# EAGLE design Digital Input Board (EAGLE 7.6.0)
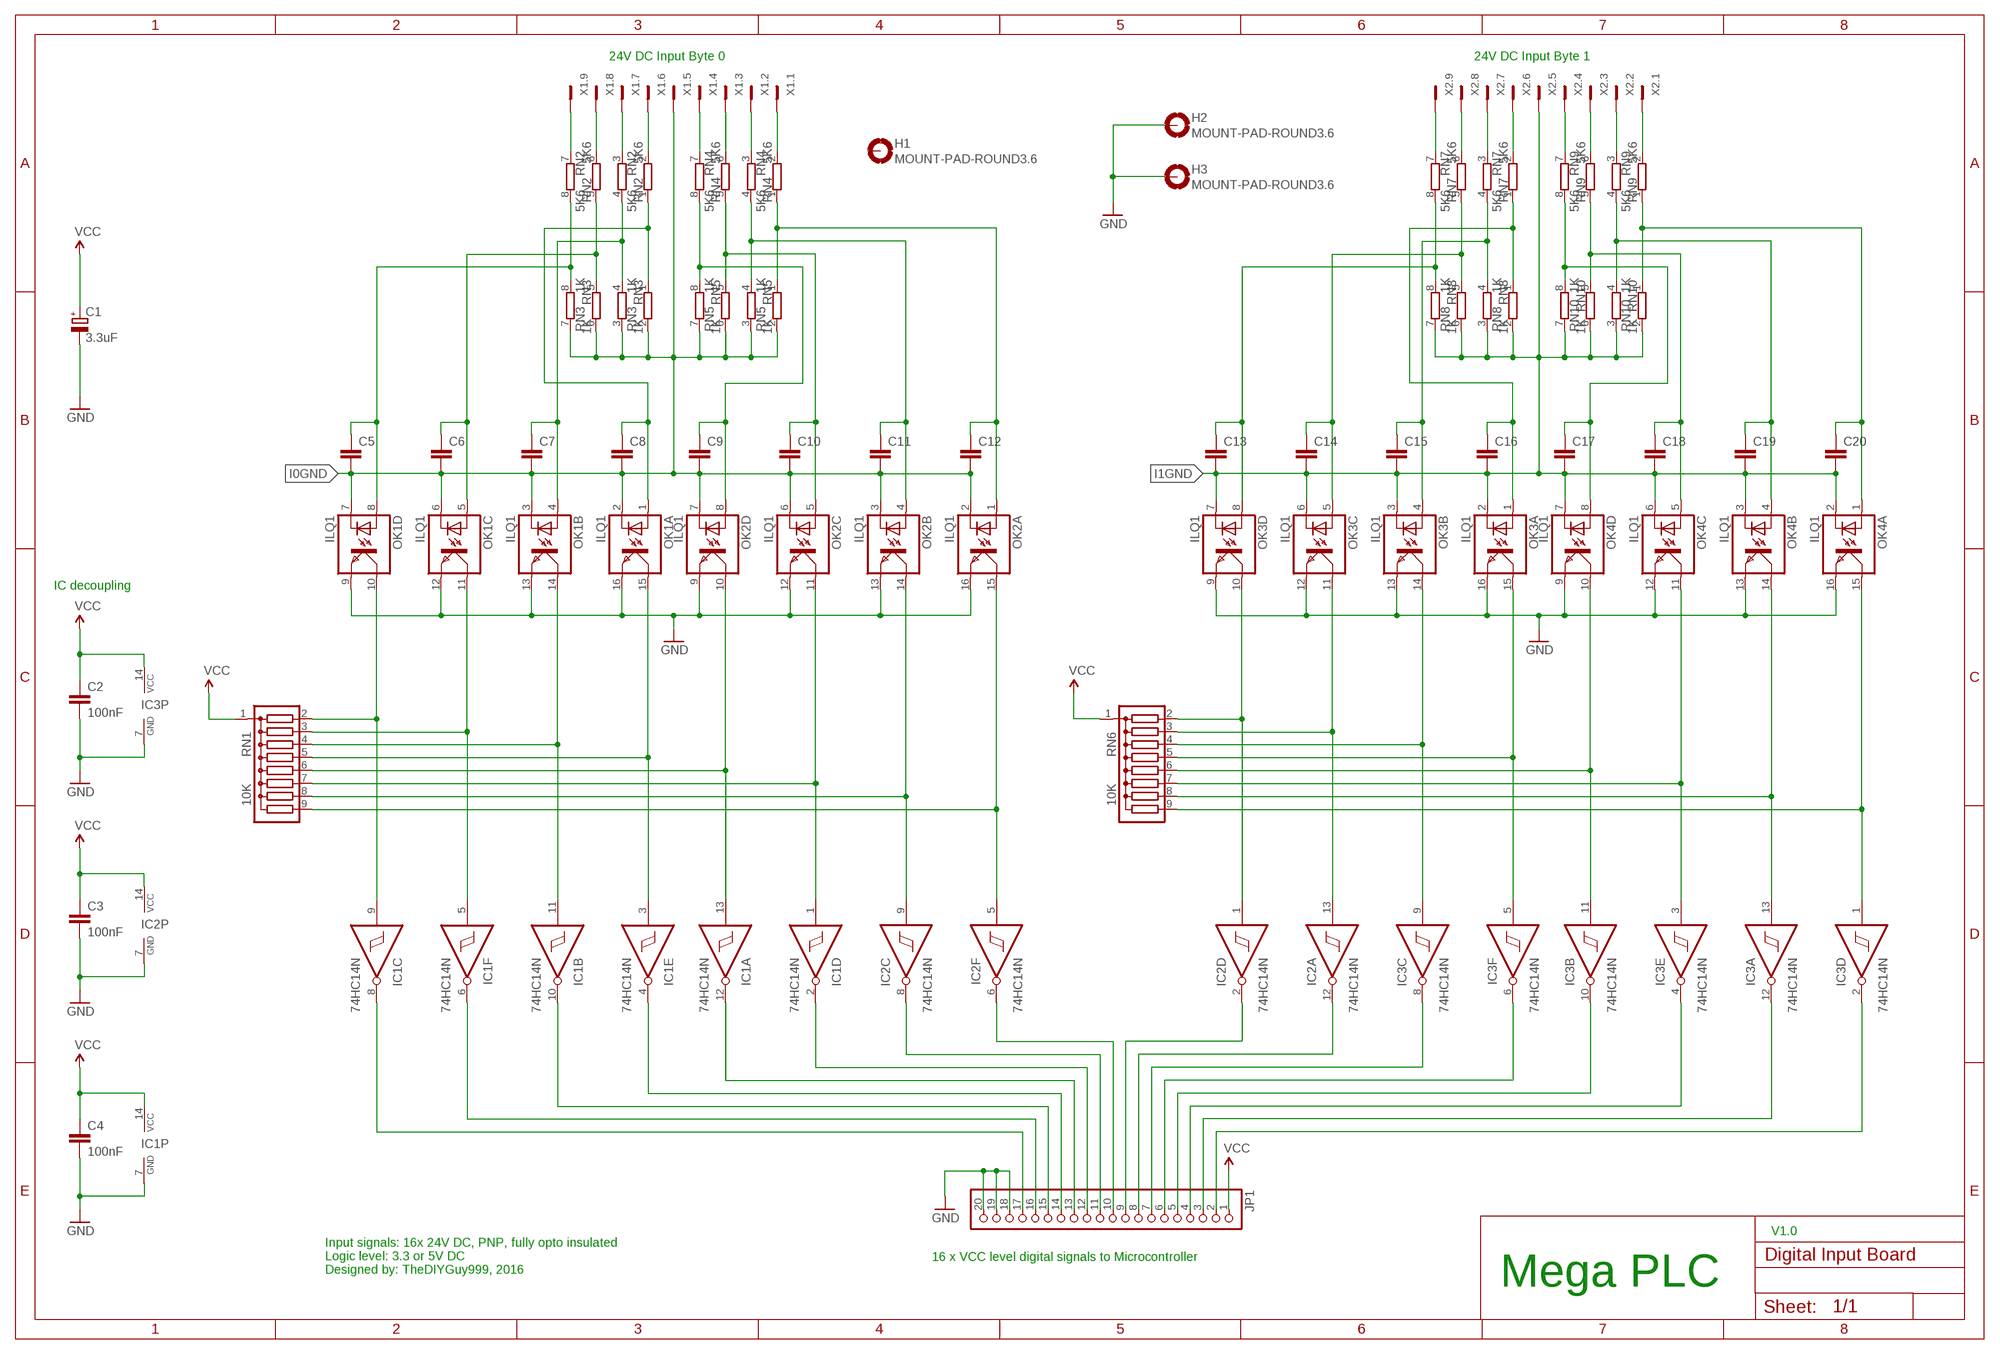
[diagram p0: schematic, sheet 1]

## Parts
C1  3.3uF  CPOL-EUB45181A  [B45181A]
C2  100nF  C-EU025-024X044  [C025-024X044]
C3  100nF  C-EU025-024X044  [C025-024X044]
C4  100nF  C-EU025-024X044  [C025-024X044]
C5  C-EUC0805K  [C0805K]
C6  C-EUC0805K  [C0805K]
C7  C-EUC0805K  [C0805K]
C8  C-EUC0805K  [C0805K]
C9  C-EUC0805K  [C0805K]
C10  C-EUC0805K  [C0805K]
C11  C-EUC0805K  [C0805K]
C12  C-EUC0805K  [C0805K]
C13  C-EUC0805K  [C0805K]
C14  C-EUC0805K  [C0805K]
C15  C-EUC0805K  [C0805K]
C16  C-EUC0805K  [C0805K]
C17  C-EUC0805K  [C0805K]
C18  C-EUC0805K  [C0805K]
C19  C-EUC0805K  [C0805K]
C20  C-EUC0805K  [C0805K]
H1  MOUNT-PAD-ROUND3.6  [3,6-PAD]
H2  MOUNT-PAD-ROUND3.6  [3,6-PAD]
H3  MOUNT-PAD-ROUND3.6  [3,6-PAD]
IC1  74HC14N  [DIL14]
IC2  74HC14N  [DIL14]
IC3  74HC14N  [DIL14]
JP1  PINHD-1X20/90  [1X20/90]
OK1  ILQ1  [DIL16]
OK2  ILQ1  [DIL16]
OK3  ILQ1  [DIL16]
OK4  ILQ1  [DIL16]
RN1  10K  G08R  [SIL9]
RN2  5K6  E4RP  [SIL8]
RN3  1K  E4RP  [SIL8]
RN4  5K6  E4RP  [SIL8]
RN5  1K  E4RP  [SIL8]
RN6  10K  G08R  [SIL9]
RN7  5K6  E4RP  [SIL8]
RN8  1K  E4RP  [SIL8]
RN9  5K6  E4RP  [SIL8]
RN10  1K  E4RP  [SIL8]
X1  MC9  [MC9]
X2  MC9  [MC9]

## Nets
GND [GND]: C1.- C2.2 C3.2 C4.2 H2.B3,6(MOUNT) H3.B3,6(MOUNT) IC1.7(P:GND) IC2.7(P:GND) IC3.7(P:GND) JP1.18 JP1.19 JP1.20 OK1.9(D:EMIT) OK1.12(C:EMIT) OK1.13(B:EMIT) OK1.16(A:EMIT) OK2.9(D:EMIT) OK2.12(C:EMIT) OK2.13(B:EMIT) OK2.16(A:EMIT) OK3.9(D:EMIT) OK3.12(C:EMIT) OK3.13(B:EMIT) OK3.16(A:EMIT) OK4.9(D:EMIT) OK4.12(C:EMIT) OK4.13(B:EMIT) OK4.16(A:EMIT)
I0GND [GND]: C5.2 C6.2 C7.2 C8.2 C9.2 C10.2 C11.2 C12.2 OK1.2(A:C) OK1.3(B:C) OK1.6(C:C) OK1.7(D:C) OK2.2(A:C) OK2.3(B:C) OK2.6(C:C) OK2.7(D:C) RN3.2 RN3.3 RN3.6 RN3.7 RN5.2 RN5.3 RN5.6 RN5.7 X1.5
I1GND [GND]: C13.2 C14.2 C15.2 C16.2 C17.2 C18.2 C19.2 C20.2 OK3.2(A:C) OK3.3(B:C) OK3.6(C:C) OK3.7(D:C) OK4.2(A:C) OK4.3(B:C) OK4.6(C:C) OK4.7(D:C) RN8.2 RN8.3 RN8.6 RN8.7 RN10.2 RN10.3 RN10.6 RN10.7 X2.5
N$1 [24V]: RN9.7 X2.4
N$2 [24V]: RN9.6 X2.3
N$3 [24V]: RN9.3 X2.2
N$4 [24V]: RN9.2 X2.1
N$5: C20.1 OK4.1(A:A) RN9.1 RN10.1
N$6: C19.1 OK4.4(B:A) RN9.4 RN10.4
N$7: C18.1 OK4.5(C:A) RN9.5 RN10.5
N$8: C17.1 OK4.8(D:A) RN9.8 RN10.8
N$9: IC3.1(D:I) OK4.15(A:COL) RN6.9
N$10: IC3.13(A:I) OK4.14(B:COL) RN6.8
N$11: IC3.3(E:I) OK4.11(C:COL) RN6.7
N$12 [24V]: RN7.2 X2.6
N$13: IC2.13(A:I) OK3.11(C:COL) RN6.3
N$14 [24V]: RN7.7 X2.9
N$15: IC3.11(B:I) OK4.10(D:COL) RN6.6
N$16 [24V]: RN7.6 X2.8
N$17 [24V]: RN7.3 X2.7
N$18: C16.1 OK3.1(A:A) RN7.1 RN8.1
N$19: C15.1 OK3.4(B:A) RN7.4 RN8.4
N$20: C14.1 OK3.5(C:A) RN7.5 RN8.5
N$21: C13.1 OK3.8(D:A) RN7.8 RN8.8
N$22: IC3.5(F:I) OK3.15(A:COL) RN6.5
N$23: IC3.9(C:I) OK3.14(B:COL) RN6.4
N$24: C12.1 OK2.1(A:A) RN4.1 RN5.1
N$25: C11.1 OK2.4(B:A) RN4.4 RN5.4
N$26: C10.1 OK2.5(C:A) RN4.5 RN5.5
N$27: C9.1 OK2.8(D:A) RN4.8 RN5.8
N$28 [24V]: RN4.7 X1.4
N$29 [24V]: RN4.6 X1.3
N$30 [24V]: RN4.3 X1.2
N$31 [24V]: RN4.2 X1.1
N$32: IC2.1(D:I) OK3.10(D:COL) RN6.2
N$33: IC2.5(F:I) OK2.15(A:COL) RN1.9
N$34: IC2.9(C:I) OK2.14(B:COL) RN1.8
N$35: IC1.1(D:I) OK2.11(C:COL) RN1.7
N$36 [24V]: RN2.2 X1.6
N$37 [24V]: RN2.6 X1.8
N$38 [24V]: RN2.7 X1.9
N$39 [24V]: RN2.3 X1.7
N$40: C8.1 OK1.1(A:A) RN2.1 RN3.1
N$41: C7.1 OK1.4(B:A) RN2.4 RN3.4
N$42: C6.1 OK1.5(C:A) RN2.5 RN3.5
N$43: C5.1 OK1.8(D:A) RN2.8 RN3.8
N$44: IC1.13(A:I) OK2.10(D:COL) RN1.6
N$45: IC1.3(E:I) OK1.15(A:COL) RN1.5
N$46: IC1.11(B:I) OK1.14(B:COL) RN1.4
N$47: IC1.5(F:I) OK1.11(C:COL) RN1.3
N$48: IC1.9(C:I) OK1.10(D:COL) RN1.2
N$49: IC3.2(D:O) JP1.2
N$50: IC3.12(A:O) JP1.3
N$51: IC3.4(E:O) JP1.4
N$52: IC3.10(B:O) JP1.5
N$53: IC3.6(F:O) JP1.6
N$54: IC3.8(C:O) JP1.7
N$55: IC2.12(A:O) JP1.8
N$56: IC2.2(D:O) JP1.9
N$57: IC2.6(F:O) JP1.10
N$58: IC2.8(C:O) JP1.11
N$59: IC1.2(D:O) JP1.12
N$60: IC1.12(A:O) JP1.13
N$61: IC1.4(E:O) JP1.14
N$62: IC1.10(B:O) JP1.15
N$63: IC1.6(F:O) JP1.16
N$64: IC1.8(C:O) JP1.17
VCC [VCC]: C1.+ C2.1 C3.1 C4.1 IC1.14(P:VCC) IC2.14(P:VCC) IC3.14(P:VCC) JP1.1 RN1.1 RN6.1
Unconnected: H1.B3,6(MOUNT) IC2.3(E:I) IC2.4(E:O) IC2.10(B:O) IC2.11(B:I)

## Notes on the sheet
- 24V DC Input Byte 0 | 24V DC Input Byte 1
- IC decoupling
- V1.0
- 16 x VCC level digital signals to Microcontroller
- Input signals: 16x 24V DC, PNP, fully opto insulated
  Logic level: 3.3 or 5V DC
  Designed by: TheDIYGuy999, 2016
- Mega PLC

## Library data of the parts
C1 = rcl:CPOL-EU: POLARIZED CAPACITOR, European symbol
C2-C4 = resistor:C-EU: CAPACITOR, European symbol
C5-C20 = rcl:C-EU: CAPACITOR, European symbol
H1-H3 = holes:MOUNT-PAD-ROUND: MOUNTING PAD, round
IC1-IC3 = 74xx-eu:74*14: Hex schmitt trigger INVERTER
JP1 = pinhead:PINHD-1X20: PIN HEADER
OK1-OK4 = optocoupler:ILQ1: SIEMENS OPTO COUPLER; MF: VISHAY/TELEFUNKEN; MPN: ILQ1; OC_FARNELL: 1469501; OC_NEWARK: 88K1954
RN1 RN6 = resistor-sil:G08R: SIL RESISTOR; OC_FARNELL: unknown; OC_NEWARK: unknown
RN2-RN5 RN7-RN10 = resistor-sil:E4RP: SIL RESISTOR; OC_FARNELL: unknown; OC_NEWARK: unknown
X1 X2 = con-phoenix-381_l:MC9: Mini-Combicon 3.81mm horizontal 9-polig MC 1,5/9-G-3,81 Artikel-Nr. 1803345

## Net classes
0 default: width 0.305 mm, clearance 0.254 mm
1 GND: width 1.016 mm, clearance 0.254 mm
2 VCC: width 1.016 mm, clearance 0.254 mm
3 24V: clearance 0.381 mm

## Board
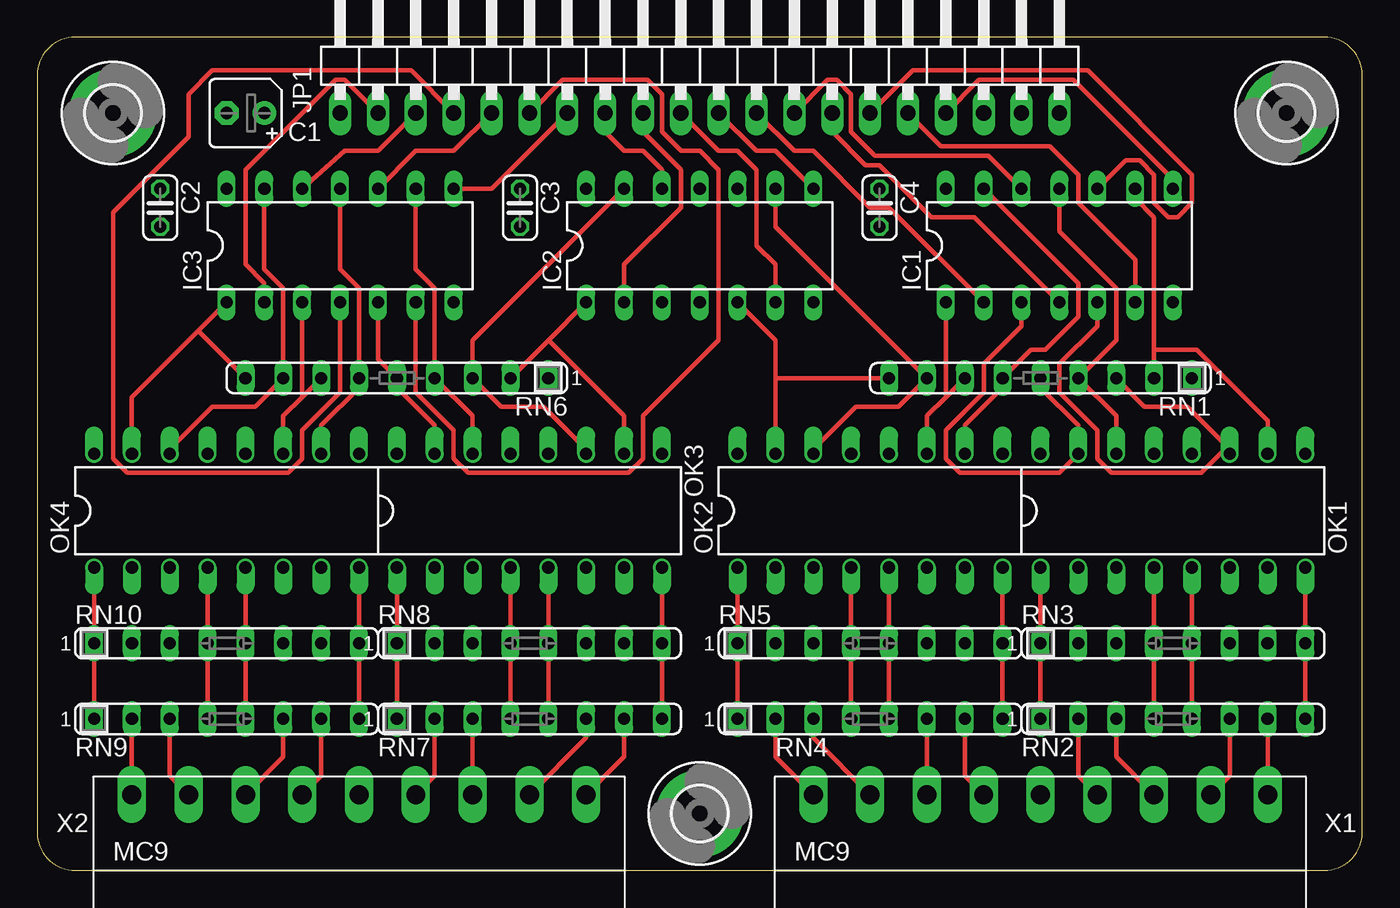
[diagram p1: board, top side]
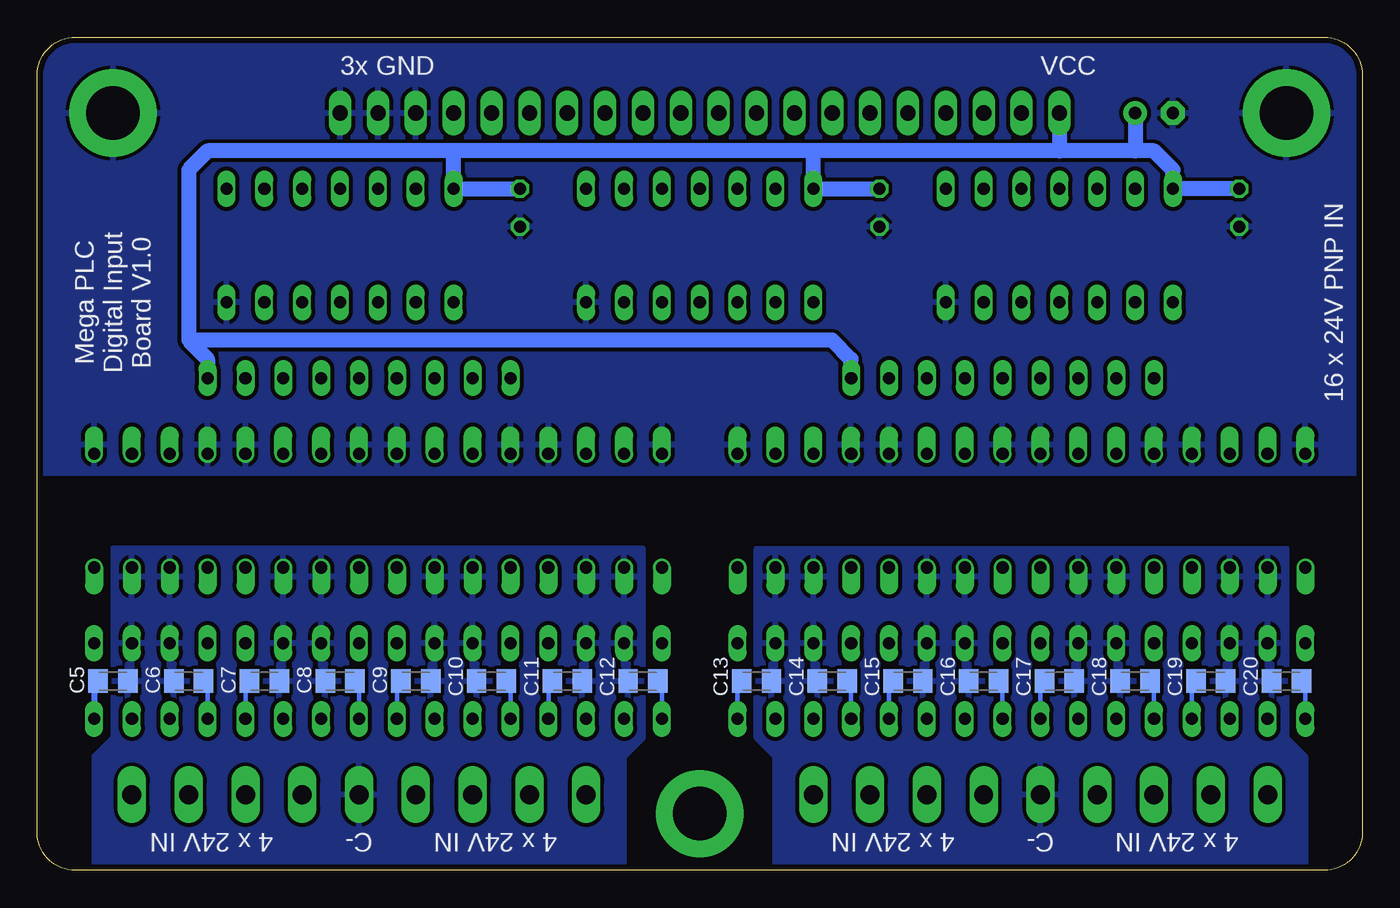
[diagram p2: board, bottom side, seen from below]

Size 88.9 x 55.88 mm. Coordinates in mm from the lower left corner, seen from the top.
Outline: 0,53.34 0,2.54 arc90 2.54,0 86.36,0 arc90 88.9,2.54 88.9,53.34 arc90 86.36,55.88 2.54,55.88 arc90 0,53.34
Copper layers (1*16): Top 0.0356mm / dielectric 1.5011mm / Bottom 0.0356mm
Design rules "OSHPark_LaenPCBOrder": minimum track width 6mil, minimum drill 13mil, track to track 6mil, track to pad 6mil, pad to pad 6mil, via to via 6mil, smd to smd 6mil, copper to edge 15mil, drill to drill 6mil, minimum pad ring 7mil, minimum via ring 7mil, stop-mask expansion 3mil, vias tented up to drill 0mil, thermal gap 10mil

### Footprints (pad centres in the part's own frame; a part is rotated, then mirrored left to right if it is on the bottom)
B45181A = drill 0.813 pad 1.6: + -1.27,0 | drill 0.813 pad 1.6 octagon: - 1.27,0
C025-024X044 = drill 0.813 octagon: 1 -1.27,0; 2 1.27,0
C0805K = smd 1.3 x 1.6: 1 -1,0; 2 1,0
3,6-PAD = drill 3.6 pad 5.842: B3,6 0,0
DIL14 = drill 0.813 long: 1 -7.62,-3.81; 2 -5.08,-3.81; 3 -2.54,-3.81; 4 0,-3.81; 5 2.54,-3.81; 6 5.08,-3.81; 7 7.62,-3.81; 8 7.62,3.81; 9 5.08,3.81; 10 2.54,3.81; 11 0,3.81; 12 -2.54,3.81; 13 -5.08,3.81; 14 -7.62,3.81
1X20/90 = drill 1.016 long: 1 -24.13,-3.81; 2 -21.59,-3.81; 3 -19.05,-3.81; 4 -16.51,-3.81; 5 -13.97,-3.81; 6 -11.43,-3.81; 7 -8.89,-3.81; 8 -6.35,-3.81; 9 -3.81,-3.81; 10 -1.27,-3.81; 11 1.27,-3.81; 12 3.81,-3.81; 13 6.35,-3.81; 14 8.89,-3.81; 15 11.43,-3.81; 16 13.97,-3.81; 17 16.51,-3.81; 18 19.05,-3.81; 19 21.59,-3.81; 20 24.13,-3.81
DIL16 = drill 0.813 offset: 1 -8.89,-3.81; 2 -6.35,-3.81; 3 -3.81,-3.81; 4 -1.27,-3.81; 5 1.27,-3.81; 6 3.81,-3.81; 7 6.35,-3.81; 8 8.89,-3.81; 9 8.89,3.81; 10 6.35,3.81; 11 3.81,3.81; 12 1.27,3.81; 13 -1.27,3.81; 14 -3.81,3.81; 15 -6.35,3.81; 16 -8.89,3.81
SIL9 = drill 0.813 long: 1 -10.16,0; 2 -7.62,0; 3 -5.08,0; 4 -2.54,0; 5 0,0; 6 2.54,0; 7 5.08,0; 8 7.62,0; 9 10.16,0
SIL8 = drill 0.813 long: 1 -8.89,0; 2 -6.35,0; 3 -3.81,0; 4 -1.27,0; 5 1.27,0; 6 3.81,0; 7 6.35,0; 8 8.89,0
MC9 = drill 1.27 long: 1 -15.24,0; 2 -11.43,0; 3 -7.62,0; 4 -3.81,0; 5 0,0; 6 3.81,0; 7 7.62,0; 8 11.43,0; 9 15.24,0

### Placement (x,y rotation side)
C1  13.97,50.8 180 top
C2  8.26,44.45 270 top
C3  32.38,44.45 270 top
C4  56.52,44.45 270 top
C5  83.82,12.7 0 bottom
C6  78.74,12.7 180 bottom
C7  73.66,12.7 0 bottom
C8  68.58,12.7 180 bottom
C9  63.5,12.7 0 bottom
C10  58.42,12.7 180 bottom
C11  53.34,12.7 0 bottom
C12  48.26,12.7 180 bottom
C13  40.64,12.7 0 bottom
C14  35.56,12.7 180 bottom
C15  30.48,12.7 0 bottom
C16  25.4,12.7 180 bottom
C17  20.32,12.7 0 bottom
C18  15.24,12.7 180 bottom
C19  10.16,12.7 0 bottom
C20  5.08,12.7 180 bottom
H1  44.45,3.81 0 top
H2  5.08,50.8 0 top
H3  83.82,50.8 0 top
IC1  68.58,41.91 0 top
IC2  44.45,41.91 0 top
IC3  20.32,41.91 0 top
JP1  44.45,54.61 0 top
OK1  76.2,24.13 0 top
OK2  55.88,24.13 0 top
OK3  33.02,24.13 0 top
OK4  12.7,24.13 0 top
RN1  67.31,33.02 180 top
RN2  76.2,10.16 0 top
RN3  76.2,15.24 0 top
RN4  55.88,10.16 0 top
RN5  55.88,15.24 0 top
RN6  24.13,33.02 180 top
RN7  33.02,10.16 0 top
RN8  33.02,15.24 0 top
RN9  12.7,10.16 0 top
RN10  12.7,15.24 0 top
X1  67.31,5.08 0 top
X2  21.59,5.08 0 top

### Tracks (layer width: path | path; a pad name or v marks a point on that pad's centre or on a via)
GND
  pour Bottom: -1.27,57.15 90.17,57.15 90.17,26.67 -1.27,26.67
I0GND
  pour Bottom: 49.53,-1.27 49.53,7.62 48.26,8.89 48.26,21.59 83.82,21.59 83.82,8.89 85.09,7.62 85.09,-1.27
I1GND
  pour Bottom: 39.37,-1.27 39.37,7.62 40.64,8.89 40.64,21.59 5.08,21.59 5.08,8.89 3.81,7.62 3.81,-1.27
N$1
  Top 0.305: RN9.7 19.05,6.35 X2.4
N$2
  Top 0.305: RN9.6 16.51,7.62 X2.3
N$3
  Top 0.305: RN9.3 8.89,6.35 X2.2
N$4
  Top 0.305: X2.1 RN9.2
N$5
  Top 0.305: RN9.1 RN10.1 OK4.1
  Bottom 0.305: RN9.1 3.81,12.7 C20.1
N$6
  Top 0.305: RN9.4 RN10.4 OK4.4
  Bottom 0.305: RN9.4 11.43,12.7 C19.1
N$7
  Top 0.305: RN9.5 RN10.5 OK4.5
  Bottom 0.305: RN9.5 13.97,12.7 C18.1
N$8
  Top 0.305: RN9.8 RN10.8 OK4.8
  Bottom 0.305: RN9.8 21.59,12.7 C17.1
N$9
  Top 0.305: OK4.15 6.35,31.75 10.79,36.2 | IC3.1 10.79,36.2 | 10.79,36.2 RN6.9
N$10
  Top 0.305: OK4.14 8.89,28.26 11.75,31.11 14.61,31.11 RN6.8 16.51,39.05 15.24,40.32 IC3.13
N$11
  Top 0.305: OK4.11 16.51,30.48 17.78,31.75 | RN6.7 17.78,31.75 | 17.78,31.75 IC3.3
N$12
  Top 0.305: RN7.2 26.67,6.35 X2.6
N$13
  Top 0.305: IC2.13 29.21,35.56 RN6.3 31.11,31.11 33.97,31.11 36.83,28.26 OK3.11
N$14
  Top 0.305: RN7.7 39.37,7.62 X2.9
N$15
  Top 0.305: OK4.10 19.05,29.84 21.59,32.38 RN6.6 21.59,39.05 20.32,40.32 IC3.11
N$16
  Top 0.305: RN7.6 36.83,8.89 X2.8
N$17
  Top 0.305: X2.7 RN7.3
N$18
  Top 0.305: RN7.1 RN8.1 OK3.1
  Bottom 0.305: RN7.1 24.13,12.7 C16.1
N$19
  Top 0.305: RN7.4 RN8.4 OK3.4
  Bottom 0.305: RN7.4 31.75,12.7 C15.1
N$20
  Top 0.305: RN7.5 RN8.5 OK3.5
  Bottom 0.305: RN7.5 34.29,12.7 C14.1
N$21
  Top 0.305: RN7.8 RN8.8 OK3.8
  Bottom 0.305: RN7.8 41.91,12.7 C13.1
N$22
  Top 0.305: OK3.15 26.67,29.84 24.13,32.38 RN6.5 22.86,34.29 IC3.5
N$23
  Top 0.305: OK3.14 29.21,30.48 RN6.4 26.67,39.05 25.4,40.32 IC3.9
N$24
  Top 0.305: RN4.1 RN5.1 OK2.1
  Bottom 0.305: RN4.1 46.99,12.7
  Bottom 0.406: 46.99,12.7 C12.1
N$25
  Top 0.305: RN4.4 RN5.4 OK2.4
  Bottom 0.305: RN4.4 54.61,12.7
  Bottom 0.406: 54.61,12.7 C11.1
N$26
  Top 0.305: RN4.5 RN5.5 OK2.5
  Bottom 0.305: RN4.5 57.15,12.7
  Bottom 0.406: 57.15,12.7 C10.1
N$27
  Top 0.305: RN4.8 RN5.8 OK2.8
  Bottom 0.305: RN4.8 64.77,12.7
  Bottom 0.406: 64.77,12.7 C9.1
N$28
  Top 0.305: RN4.7 62.23,6.35 X1.4
N$29
  Top 0.305: X1.3 RN4.6
N$30
  Top 0.305: RN4.3 52.07,8.89 X1.2
N$31
  Top 0.305: RN4.2 49.53,7.62 X1.1
N$32
  Top 0.305: IC2.1 34.29,35.56 | 34.29,35.56 RN6.2 | OK3.10 39.37,30.48 34.29,35.56
N$33
  Top 0.305: 49.53,33.02 49.53,35.56 IC2.5 | 49.53,33.02 OK2.15 | 49.53,33.02 RN1.9
N$34
  Top 0.305: OK2.14 52.07,28.26 54.93,31.11 57.78,31.11 RN1.8 49.53,43.18 IC2.9
N$35
  Top 0.305: OK2.11 59.69,30.48 60.96,31.75 | RN1.7 60.96,31.75 | 60.96,31.75 IC1.1
N$36
  Top 0.305: RN2.2 69.85,6.35 X1.6
N$37
  Top 0.305: RN2.6 80.01,6.35 X1.8
N$38
  Top 0.305: X1.9 RN2.7
N$39
  Top 0.305: RN2.3 72.39,7.62 X1.7
N$40
  Top 0.305: RN2.1 RN3.1 OK1.1
  Bottom 0.305: RN2.1 67.31,12.7
  Bottom 0.406: 67.31,12.7 C8.1
N$41
  Top 0.305: RN2.4 RN3.4 OK1.4
  Bottom 0.305: RN2.4 74.93,12.7
  Bottom 0.406: 74.93,12.7 C7.1
N$42
  Top 0.305: RN2.5 RN3.5 OK1.5
  Bottom 0.305: RN2.5 77.47,12.7
  Bottom 0.406: 77.47,12.7 C6.1
N$43
  Top 0.305: RN2.8 RN3.8 OK1.8
  Bottom 0.406: C5.1 85.09,12.7 RN2.8
N$44
  Top 0.305: OK2.10 62.23,29.84 64.77,32.38 RN1.6 66.67,34.92 67.63,34.92 69.85,37.15 69.85,39.37 IC1.13
N$45
  Top 0.305: RN1.5 67.31,32.38 69.85,29.84 OK1.15 68.58,26.67 61.91,26.67 60.96,27.62 60.96,29.53 63.5,32.07 63.5,33.97 66.04,36.51 IC1.3
N$46
  Top 0.305: OK1.14 72.39,30.48 RN1.4 72.39,35.56 72.39,39.05 68.58,42.86 IC1.11
N$47
  Top 0.305: 79.69,28.26 79.69,28.57 77.15,31.11 74.3,31.11 RN1.3 | IC1.5 71.12,36.51 68.58,33.97 68.58,32.07 71.12,29.53 71.12,27.62 72.07,26.67 78.11,26.67 79.69,28.26 | 79.69,28.26 OK1.11
N$48
  Top 0.305: 74.93,34.92 74.93,43.81 73.66,45.09 IC1.9 | 74.93,34.92 RN1.2 | OK1.10 82.55,30.16 77.79,34.92 74.93,34.92
N$49
  Top 0.305: IC3.2 15.24,39.37 13.97,40.64 13.97,46.99 20,53.02 20.64,53.02 JP1.2
N$50
  Top 0.305: IC3.12 20.64,48.26 22.86,48.26 JP1.3
N$51
  Top 0.305: IC3.4 20.32,32.07 17.78,29.53 17.78,27.62 16.83,26.67 6.03,26.67 5.08,27.62 5.08,44.13 10.16,49.21 10.16,52.07 11.75,53.66 25.08,53.66 JP1.4
N$52
  Top 0.305: IC3.10 25.4,48.26 27.94,48.26 JP1.5
N$53
  Top 0.305: IC3.6 25.4,32.07 27.94,29.53 27.94,27.62 28.89,26.67 39.69,26.67 40.64,27.62 40.64,30.48 45.72,35.56 45.72,46.99 44.45,48.26 43.18,48.26 41.91,49.53 41.91,52.07 40.96,53.02 35.24,53.02 JP1.6
N$54
  Top 0.305: IC3.8 30.48,45.72 JP1.7
N$55
  Top 0.305: JP1.8 38.1,49.53 39.37,48.26 40.64,48.26 41.91,46.99 IC2.12
N$56
  Top 0.305: JP1.9 40.64,49.53 43.18,46.99 43.18,44.45 39.37,40.64 IC2.2
N$57
  Top 0.305: IC2.6 49.53,40.64 48.26,41.91 48.26,46.99 46.99,48.26 45.72,48.26 JP1.10
N$58
  Top 0.305: IC2.8 49.53,48.26 48.26,48.26 JP1.11
N$59
  Top 0.305: IC1.2 57.15,44.45 55.88,44.45 52.07,48.26 50.8,48.26 JP1.12
N$60
  Top 0.305: IC1.12 63.82,47.94 56.2,47.94 54.61,49.53 54.61,52.07 53.66,53.02 53.02,53.02 JP1.13
N$61
  Top 0.305: IC1.4 62.87,43.81 60.01,43.81 56.52,47.31 55.56,47.31 53.34,49.53 JP1.14
N$62
  Top 0.305: IC1.10 73.03,47.62 73.98,47.62 74.93,46.67 74.93,44.77 75.88,43.81 76.52,43.81 77.47,44.77 77.47,46.67 70.48,53.66 58.74,53.66 JP1.15
N$63
  Top 0.305: IC1.6 73.66,40.96 69.85,44.77 69.85,46.67 67.94,48.58 60.64,48.58 JP1.16
N$64
  Top 0.305: IC1.8 76.2,46.35 69.53,53.02 63.18,53.02 JP1.17
VCC
  Bottom 1.016: C2.1 IC3.14 12.7,46.99 13.97,48.26 15.24,48.26 | 15.24,48.26 20.32,48.26 | 20.32,48.26 36.83,48.26 | 36.83,48.26 60.96,48.26 | 60.96,48.26 77.47,48.26 78.74,46.99 78.74,35.56 | 78.74,35.56 77.47,34.29 RN1.1 | JP1.1 20.32,48.26 | RN6.1 34.29,34.29 35.56,35.56 78.74,35.56 | 36.83,48.26 IC2.14 C3.1 | 60.96,48.26 IC1.14 C4.1 | C1.+ 15.24,48.26

### Text on the board
bNames: VCC | 3x GND | 16 x 24V PNP IN | Mega PLC / Digital Input / Board V1.0 | 4 x 24V IN | C- | 4 x 24V IN | 4 x 24V IN | C- | 4 x 24V IN